# EAGLE design DualBalancedOutput (EAGLE 6.6.0)
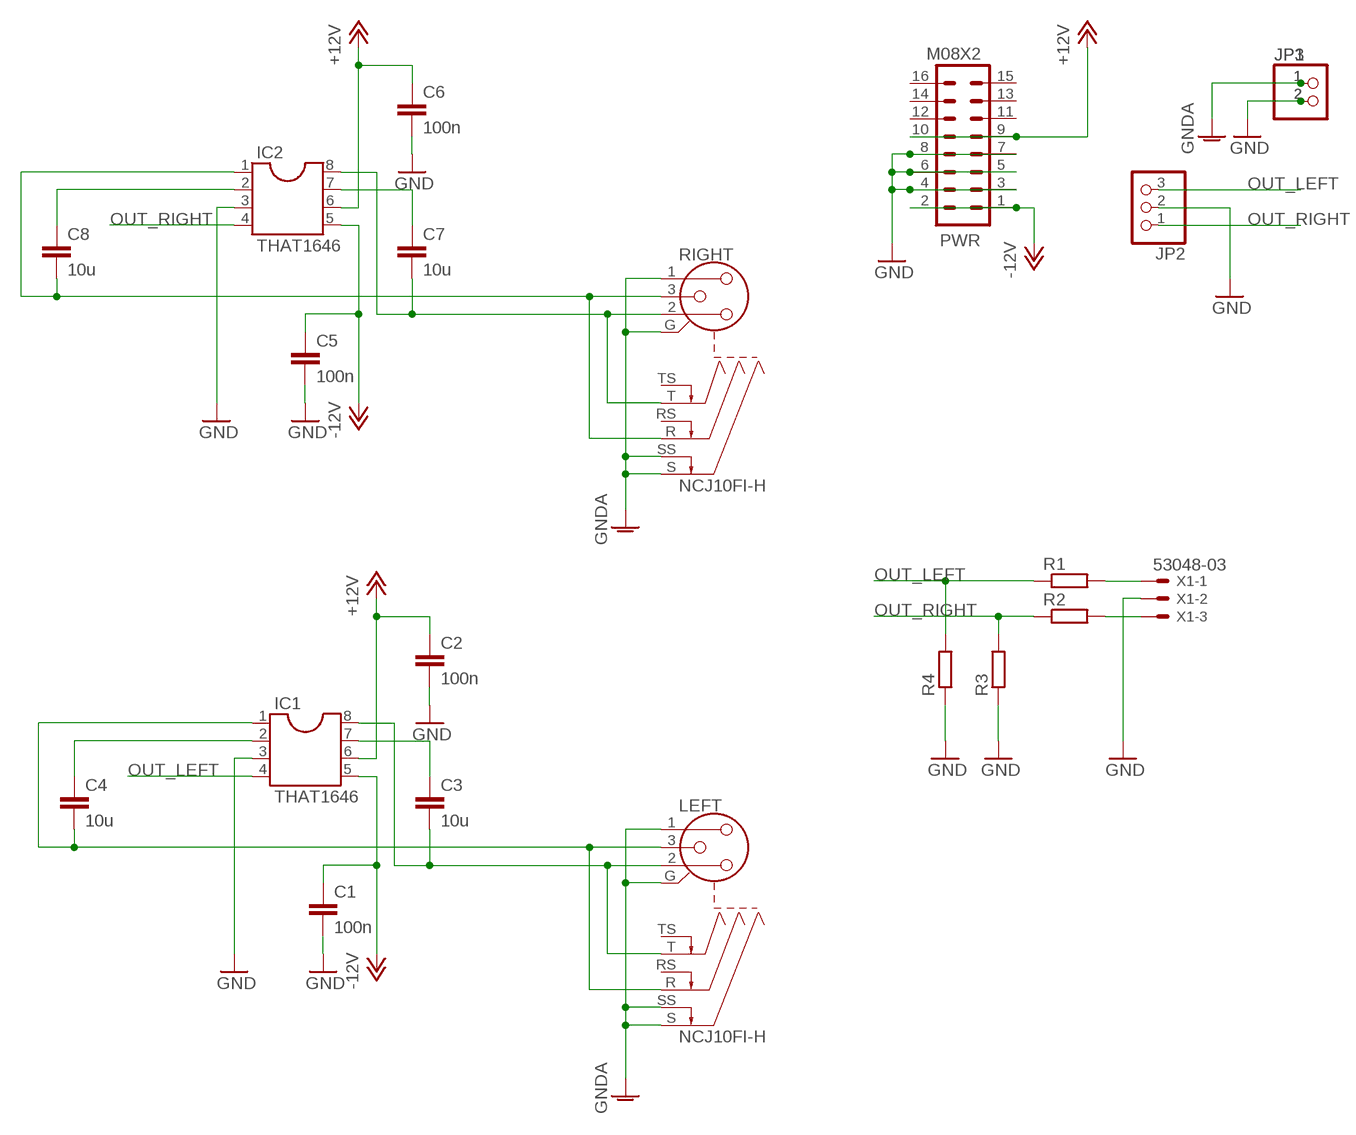
[diagram p0: schematic, sheet 1]

## Parts
C1  100n  C-EU050-025X075  [C050-025X075]
C2  100n  C-EU050-025X075  [C050-025X075]
C3  10u  C-EU050-025X075  [C050-025X075]
C4  10u  C-EU050-025X075  [C050-025X075]
C5  100n  C-EU050-025X075  [C050-025X075]
C6  100n  C-EU050-025X075  [C050-025X075]
C7  10u  C-EU050-025X075  [C050-025X075]
C8  10u  C-EU050-025X075  [C050-025X075]
IC1  THAT1646  DIL8  [DIL08]
IC2  THAT1646  DIL8  [DIL08]
JP1  PINHD-1X2  [1X02]
JP2  PINHD-1X3  [1X03]
JP3  PINHD-1X2  [1X02]
LEFT  NCJ10FI-H  [NCJ10FI-H]
PWR  M08X2  [2X8]
R1  R-EU_0207/7  [0207/7]
R2  R-EU_0207/7  [0207/7]
R3  R-EU_0207/7  [0207/7]
R4  R-EU_0207/7  [0207/7]
RIGHT  NCJ10FI-H  [NCJ10FI-H]
X1  53048-03  [53048-03]

## Nets
+12V: C2.1 C6.1 IC1.6 IC2.6 PWR.9 PWR.10
-12V: C1.1 C5.1 IC1.5 IC2.5 PWR.1 PWR.2
GND: C1.2 C2.2 C5.2 C6.2 IC1.3 IC2.3 JP1.2 JP2.2 JP3.2 PWR.3 PWR.4 PWR.5 PWR.6 PWR.7 PWR.8 R3.1 R4.1 X1.2
GNDA: JP1.1 JP3.1 LEFT.1 LEFT.G LEFT.S LEFT.SS RIGHT.1 RIGHT.G RIGHT.S RIGHT.SS
N$1: C3.2 IC1.8 LEFT.2 LEFT.T
N$2: C4.2 IC1.1 LEFT.3 LEFT.R
N$3: C3.1 IC1.7
N$4: C4.1 IC1.2
N$7: R2.2 X1.3
N$8: C7.1 IC2.7
N$9: R1.2 X1.1
N$10: C8.1 IC2.2
N$18: C7.2 IC2.8 RIGHT.2 RIGHT.T
N$19: C8.2 IC2.1 RIGHT.3 RIGHT.R
OUT_LEFT: IC1.4 JP2.3 R1.1 R4.2
OUT_RIGHT: IC2.4 JP2.1 R2.1 R3.2
Unconnected: LEFT.RS LEFT.TS PWR.11 PWR.12 PWR.13 PWR.14 PWR.15 PWR.16 RIGHT.RS RIGHT.TS

## Library data of the parts
C1-C8 = rcl:C-EU: CAPACITOR, European symbol
IC1 IC2 = ic-package:DIL8: Dual In Line / Socket
JP1 JP3 = pinhead:PINHD-1X2: PIN HEADER
JP2 = pinhead:PINHD-1X3: PIN HEADER
LEFT RIGHT = con-neutrik_ag:NCJ10FI-: Neutrik Audio Connector XLR SERIES Stereo 1/4" jack with switch Source: www.neutrik.com/; OC_FARNELL: unknown; OC_NEWARK: unknown
PWR = SparkFun:M08X2
R1-R4 = rcl:R-EU_: RESISTOR, European symbol
X1 = con-molex:53?-03: CONNECTOR wire to board 1.25 mm (.049 inch) pitch header; MF: WALDOM/MOLEX; MPN: 53048-0310; OC_FARNELL: 9732918; OC_NEWARK: 38C9908

## Board
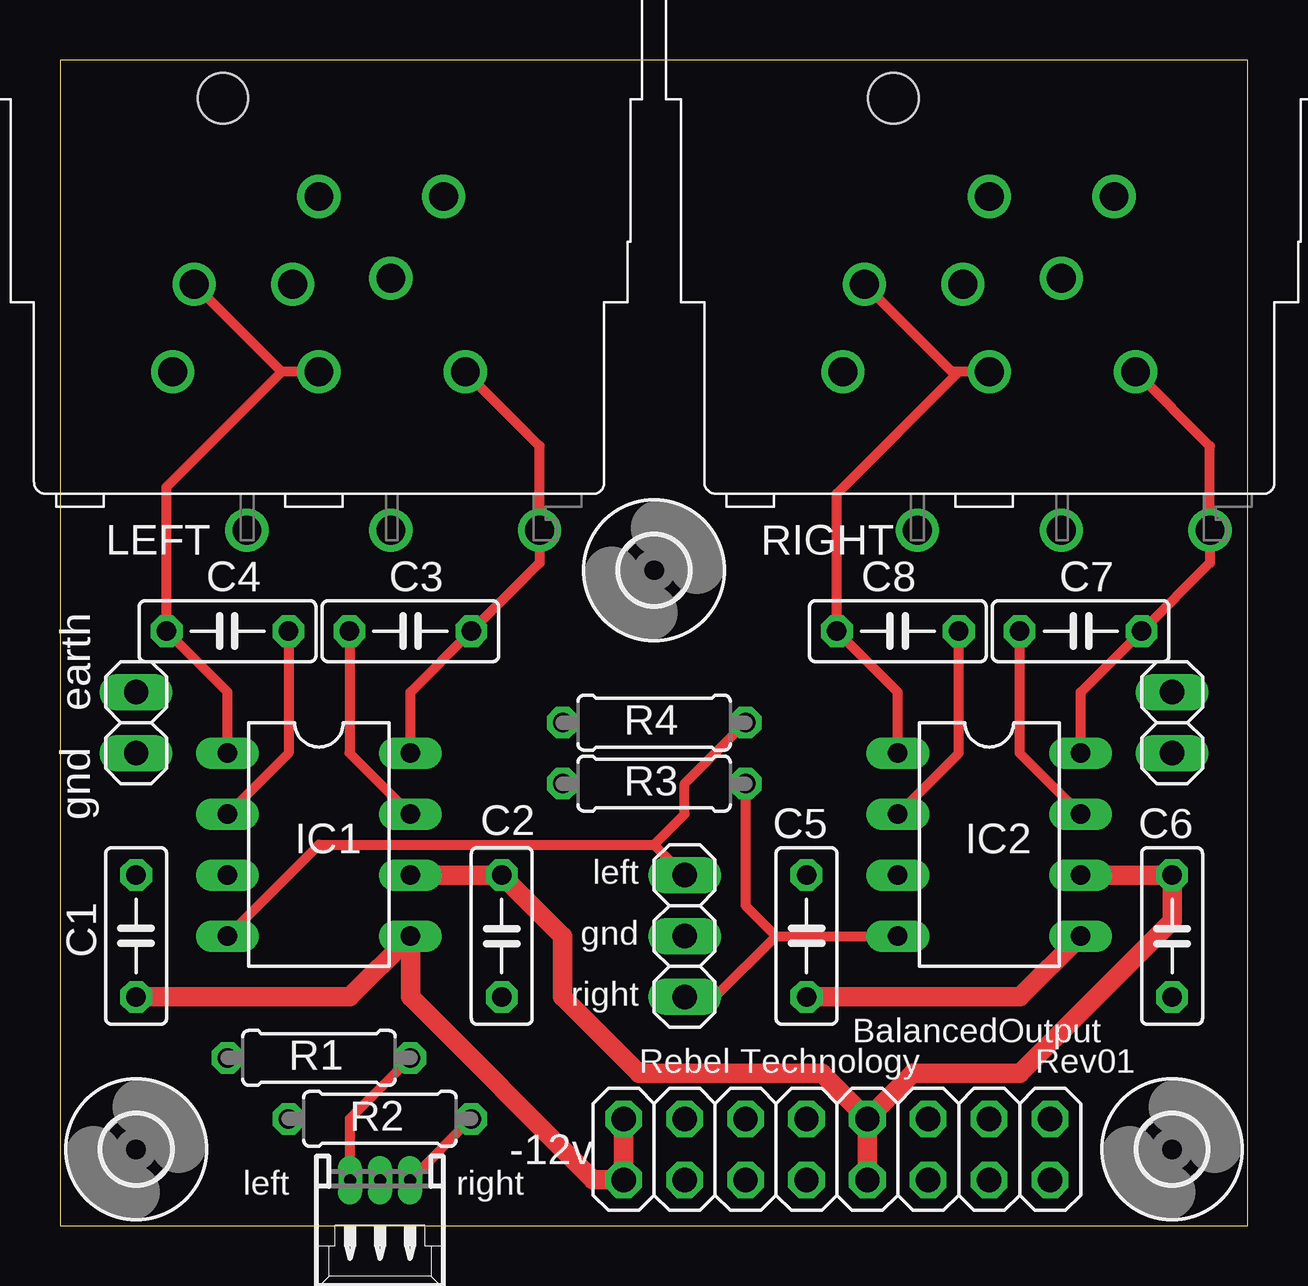
[diagram p1: board, top side]
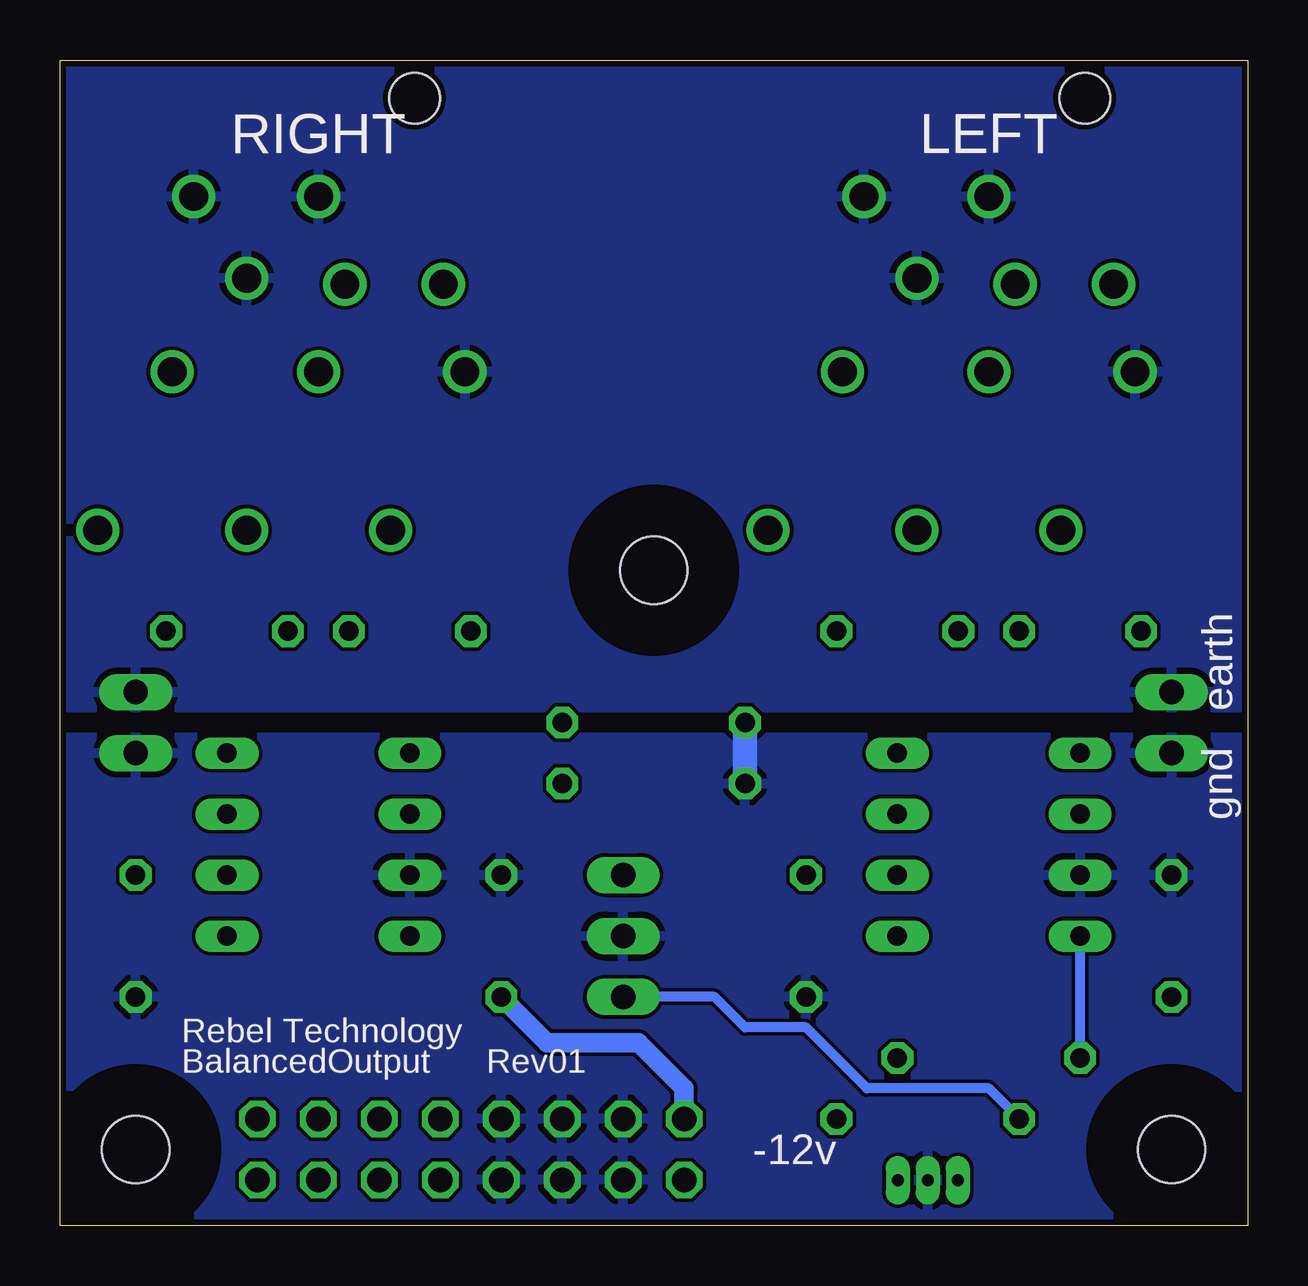
[diagram p2: board, bottom side, seen from below]

Size 49.51 x 48.57 mm. Coordinates in mm from the lower left corner, seen from the top.
Outline: 0,0 49.51,0 49.51,48.57 0,48.57 0,0
Copper layers (1*16): Top 0.035mm / dielectric 1.5mm / Bottom 0.035mm
Design rules "Fusion_eagle_rule_v1.1": minimum track width 6mil, minimum drill 12mil, track to track 6mil, track to pad 6mil, pad to pad 6mil, via to via 6mil, smd to smd 0mil, copper to edge 10mil, drill to drill 10mil, minimum pad ring 10mil, minimum via ring 6mil, stop-mask expansion 2mil, vias tented up to drill 100mil, thermal gap 10mil

### Footprints (pad centres in the part's own frame; a part is rotated, then mirrored left to right if it is on the bottom)
C050-025X075 = drill 0.813 octagon: 1 -2.54,0; 2 2.54,0
DIL08 = drill 0.813 long: 1 -3.81,-3.81; 2 -1.27,-3.81; 3 1.27,-3.81; 4 3.81,-3.81; 5 3.81,3.81; 6 1.27,3.81; 7 -1.27,3.81; 8 -3.81,3.81
1X02 = drill 1.016 long: 1 -1.27,0; 2 1.27,0
1X03 = drill 1.016 long: 1 -2.54,0; 2 0,0; 3 2.54,0
NCJ10FI-H = drill 1.2: 1 -6.1,-18.4; 2 6.1,-18.4; 3 0,-18.4; G 0,-11.1; GN -1.1,-14.75; R -5.2,-14.75; RS -3,-25; S 5.2,-11.1; SS 3,-14.5; T 9.2,-25; TS 3,-25 | hole 2.1: -4,-7
2X8 = drill 1.016 octagon: 1 0,0; 2 0,2.54; 3 2.54,0; 4 2.54,2.54; 5 5.08,0; 6 5.08,2.54; 7 7.62,0; 8 7.62,2.54; 9 10.16,0; 10 10.16,2.54; 11 12.7,0; 12 12.7,2.54; 13 15.24,0; 14 15.24,2.54; 15 17.78,0; 16 17.78,2.54
0207/7 = drill 0.813 octagon: 1 -3.81,0; 2 3.81,0
2,8 = hole 2.8: 0,0
53048-03 = drill 0.5 pad 0.698 long: 1 1.25,-1.25; 2 0,-1.25; 3 -1.25,-1.25

### Placement (x,y rotation side)
C1  3.17,12.06 90 top
C2  18.41,12.06 270 top
C3  14.61,24.77 0 top
C4  6.99,24.77 180 top
C5  31.11,12.06 90 top
C6  46.36,12.06 270 top
C7  42.55,24.77 0 top
C8  34.93,24.77 180 top
IC1  10.79,15.88 270 top
IC2  38.73,15.88 270 top
JP1  3.17,20.96 270 top
JP2  26.04,12.06 90 top
JP3  46.36,20.96 270 top
LEFT  10.79,53.98 0 top
PWR  23.49,1.91 0 top
R1  10.79,6.98 0 top
R2  13.34,4.45 0 top
R3  24.76,18.41 0 top
R4  24.76,20.96 0 top
RIGHT  38.73,53.98 0 top
U$1  [2,8]  3.17,3.18 0 top
U$2  [2,8]  46.36,3.18 0 top
U$3  [2,8]  24.76,27.3 0 top
X1  13.34,0.63 180 top

### Tracks (layer width: path | path; a pad name or v marks a point on that pad's centre or on a via)
+12V
  Top 0.813: PWR.10 31.75,6.35 24.13,6.35 20.95,9.52 20.95,12.06 C2.1 IC1.6 | PWR.10 35.56,6.35 40.01,6.35 46.36,12.7 C6.1 IC2.6 | PWR.9 PWR.10
-12V
  Top 0.813: IC2.5 40.01,9.52 C5.1 | PWR.2 PWR.1 22.22,1.91 14.61,9.52 IC1.5 12.06,9.52 C1.1
  Bottom 0.813: PWR.2 23.49,5.72 25.4,7.62 29.21,7.62 C5.1
GND
  Bottom 1.016: R4.1 R3.1
  pour Bottom: -4.45,20.32 59.05,20.32 59.05,-3.17 -4.45,-3.17
GNDA
  pour Bottom: -4.45,21.59 -4.45,51.43 59.05,51.43 59.05,21.59
N$1
  Top 0.406: IC1.8 14.61,22.23 C3.2 19.99,27.62 LEFT.T 19.99,32.48 LEFT.2
N$2
  Top 0.406: IC1.1 6.99,22.23 C4.2 4.45,30.77 9.25,35.57 | LEFT.3 9.25,35.57 | 9.25,35.57 LEFT.R
N$3
  Top 0.406: C3.1 12.06,19.68 IC1.7
N$4
  Top 0.406: C4.1 9.53,19.68 IC1.2
N$7
  Top 0.406: R2.2 X1.3
N$8
  Top 0.406: IC2.7 40.01,19.68 C7.1
N$9
  Top 0.406: X1.1 12.09,4.47 R1.2
N$10
  Top 0.406: IC2.2 37.47,19.68 C8.1
N$18
  Top 0.406: RIGHT.2 47.94,32.48 RIGHT.T 47.94,27.62 C7.2 42.55,22.23 IC2.8
N$19
  Top 0.406: RIGHT.3 37.47,35.57 | 37.47,35.57 37.19,35.57 RIGHT.R | 37.47,35.57 32.39,30.49 C8.2 34.93,22.23 IC2.1
OUT_LEFT
  Top 0.406: IC1.4 10.79,15.88 24.76,15.88 | 24.76,15.88 JP2.3 | 24.76,15.88 26.04,17.15 26.04,18.41 R4.2
  Bottom 0.406: R1.1 IC1.4
OUT_RIGHT
  Top 0.406: JP2.1 27.3,9.52 29.84,12.06 | 29.84,12.06 IC2.4 | R3.2 28.57,13.34 29.84,12.06
  Bottom 0.406: R2.1 10.79,5.72 15.88,5.72 18.41,8.26 20.95,8.26 22.22,9.52 JP2.1

### Text on the board
tPlace: earth | gnd | left | gnd | right | BalancedOutput | Rebel Technology | Rev01 | -12v | left | right
bPlace: LEFT | RIGHT | earth | gnd | Rebel Technology | Rev01 | BalancedOutput | -12v